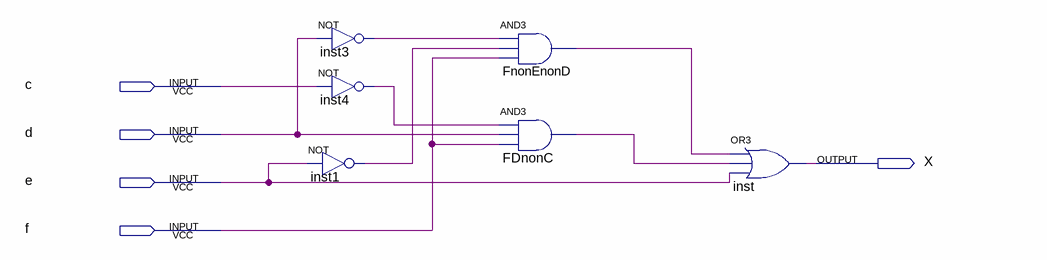
[diagram p0: schematic sheet]
// Quartus schematic JAKUJa1b1.bdf as structural Verilog: 6 symbols, 5 pins
module JAKUJa1b1 (
  input  c,
  input  d,
  input  e,
  input  f,
  output X
);

  wire FDnonC_out, FnonEnonD_out, inst1_out, inst3_out, inst4_out;

  not inst3 (inst3_out, d);
  not inst4 (inst4_out, c);
  not inst1 (inst1_out, e);
  and FnonEnonD (FnonEnonD_out, inst3_out, inst1_out, f);
  and FDnonC (FDnonC_out, inst4_out, d, f);
  or inst (X, FnonEnonD_out, FDnonC_out, e);
endmodule
